# Altium schematic sheet MIXR Power - Connectors.SchDoc: MIXR Power - Connectors
size B; Organization: Midnight Sun Solar Rayce Car Team; Address1: University of Waterloo; Address2: 200 University Ave W; Address3: Waterloo, ON, Canada; Address4: N2L 3E9; DocumentNumber: 3; SheetNumber: 3; SheetTotal: 8; Website: www.uwmidsun.com; ProjectName: ProjectName
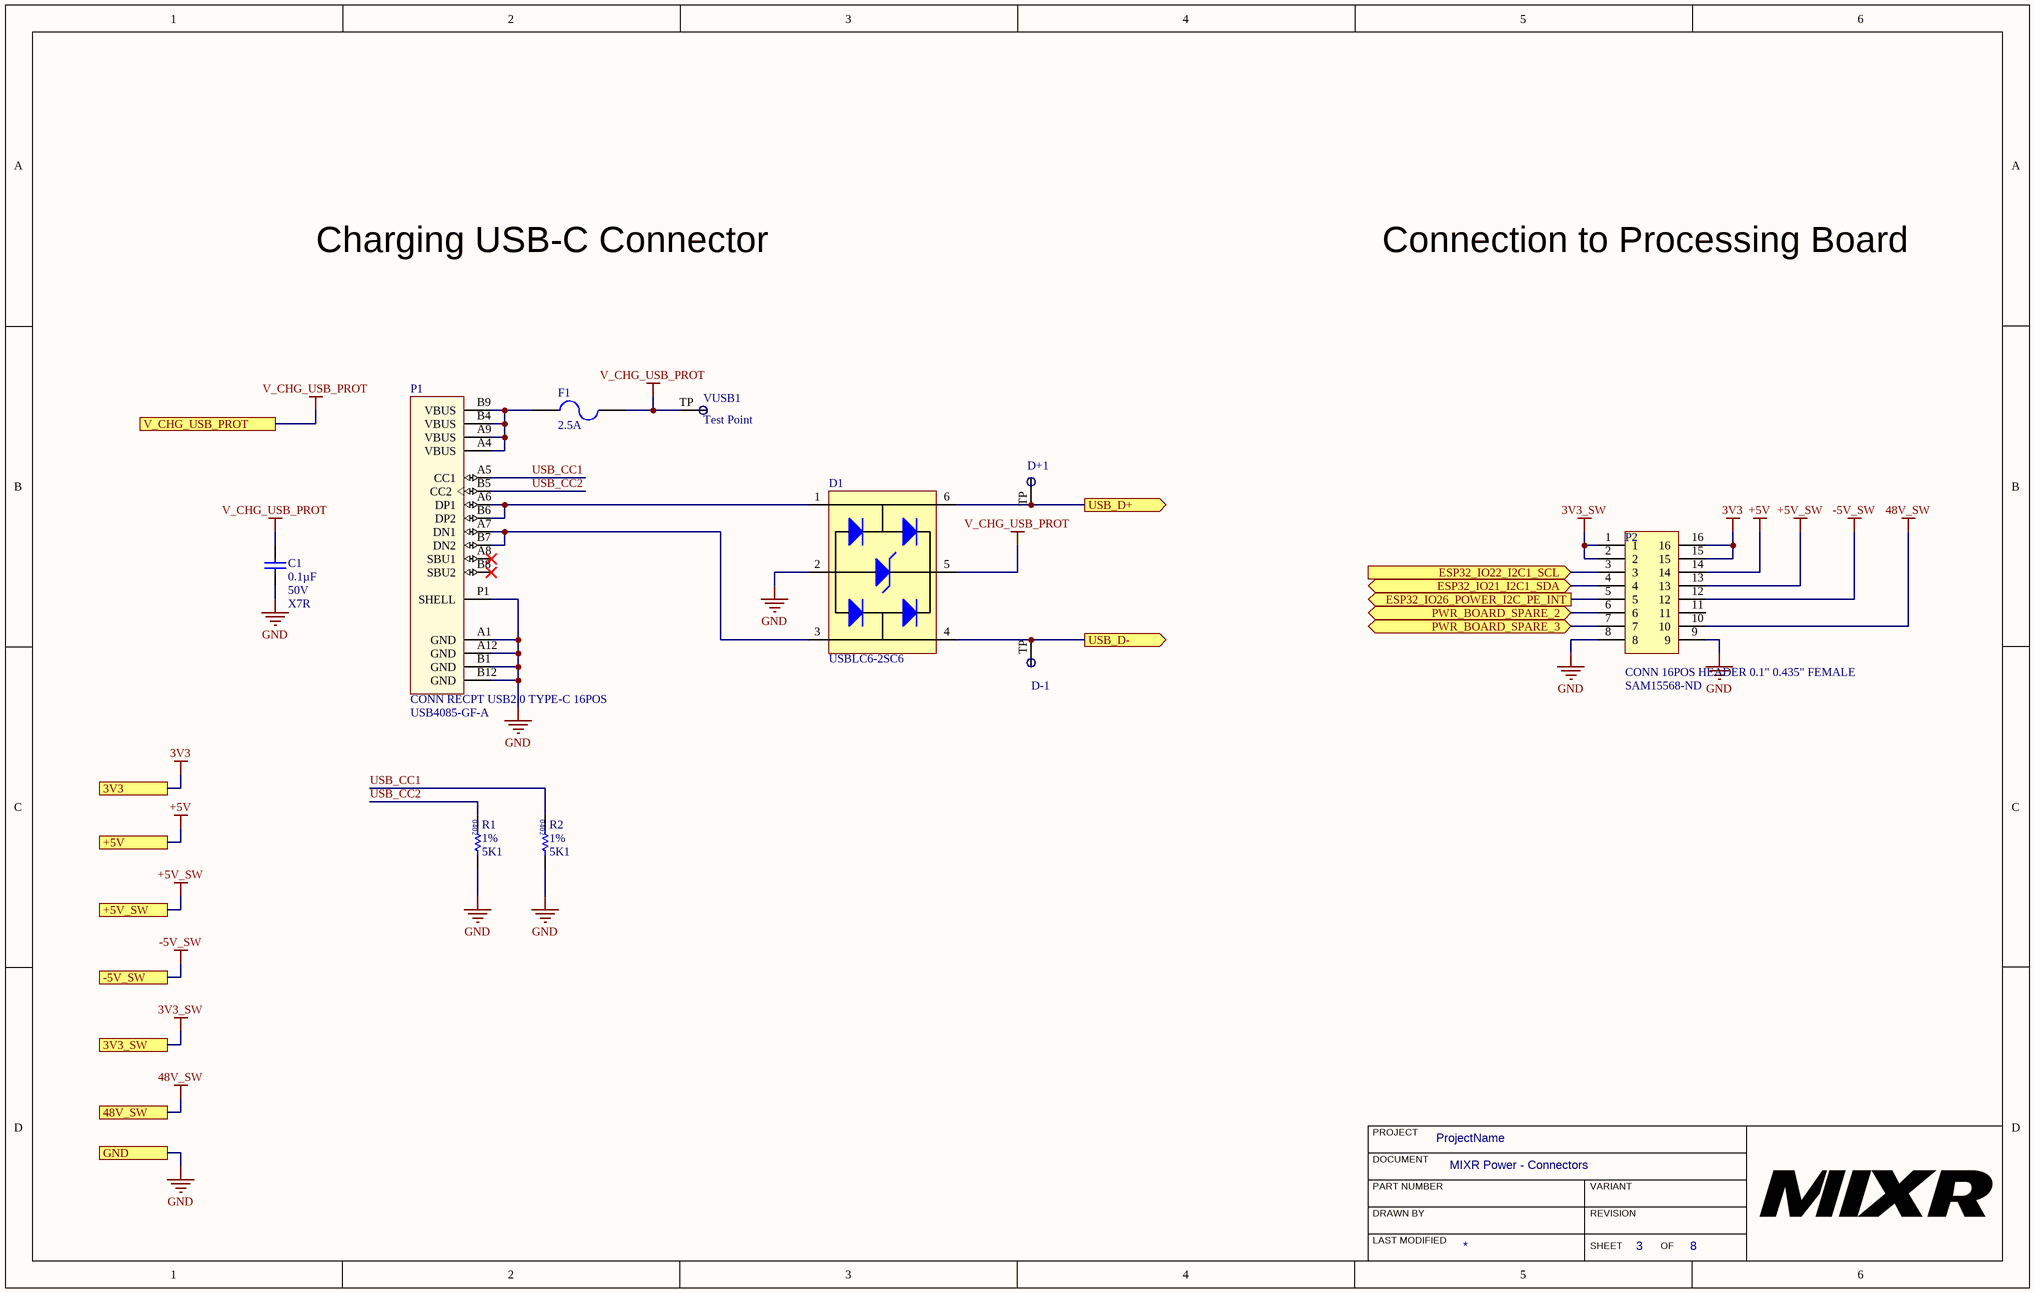
[diagram p0: MIXR Power - Connectors.SchDoc]

## Parts
C1  Capacitance: 0.1µF  Voltage: 50V  Temperature Coefficient: X7R  [CAP, 0603]  (hidden comment: CAP CER 0.1UF 50V 10% X7R 0603)
D1  Manufacturer Part Number 1: USBLC6-2SC6  [SOT23-6]  (hidden comment: DIODE TVS 5.25V 17V SOT23-6)
D+1  Test Point  [Test Point]  (value not drawn)  (no BOM)
D-1  Test Point  [Test Point]  (value not drawn)  (no BOM)
F1  Current Rating: 2.5A  [FUSE LITTLEFUSE 0466 1206]  (hidden comment: FUSE 2.5A 32VDC 1206)
P1  CONN RECPT USB2.0 TYPE-C 16POS  Manufacturer Part Number: USB4085-GF-A  [CONN RECPT USB2.0 TYPE C 16-POS]
P2  CONN 16POS HEADER 0.1" 0.435" FEMALE  Supplier Part Number 1: SAM15568-ND  [CONN, 16POS 0.100" 0.435" FEMALE]
R1  Tolerance: 1%  Resistance: 5K1  [RES 0402]  (hidden comment: RES 5.1K OHM 1% 1/16W 0402)
R2  Tolerance: 1%  Resistance: 5K1  [RES 0402]  (hidden comment: RES 5.1K OHM 1% 1/16W 0402)
VUSB1  Test Point  [Test Point]  (no BOM)

## Ports
3V3, 3V3_SW, 48V_SW, +5V, +5V_SW, -5V_SW, ESP32_IO21_I2C1_SDA (bidir), ESP32_IO22_I2C1_SCL (in), ESP32_IO26_POWER_I2C_PE_INT (out), GND, PWR_BOARD_SPARE_2 (bidir), PWR_BOARD_SPARE_3 (bidir), USB_D+ (out), USB_D- (out), V_CHG_USB_PROT

## Nets
3V3: P2.15 P2.16 ; port 3V3
3V3_SW: P2.1 P2.2 ; port 3V3_SW
48V_SW: P2.10 ; port 48V_SW
+5V: P2.14 ; port +5V
+5V_SW: P2.13 ; port +5V_SW
-5V_SW: P2.12 ; port -5V_SW
GND: C1.2 D1.2(Cathode2) P1.A1(GND) P1.A12(GND) P1.B1(GND) P1.B12(GND) P1.P1(SHELL) P2.8 P2.9 R1.2 R2.2 ; port GND
V_CHG_USB_PROT: C1.1 D1.5(Cathode4) F1.2 VUSB1.TP ; port V_CHG_USB_PROT
ESP32_IO21_I2C1_SDA: P2.4 ; port ESP32_IO21_I2C1_SDA
ESP32_IO22_I2C1_SCL: P2.3 ; port ESP32_IO22_I2C1_SCL
ESP32_IO26_POWER_I2C_PE_INT: P2.5 ; port ESP32_IO26_POWER_I2C_PE_INT
PWR_BOARD_SPARE_2: P2.6 ; port PWR_BOARD_SPARE_2
PWR_BOARD_SPARE_3: P2.7 ; port PWR_BOARD_SPARE_3
USB_CC1: P1.A5(CC1) R2.1
USB_CC2: P1.B5(CC2) R1.1
USB_D+: D1.6(Cathode3) D+1.TP ; port USB_D+
USB_D-: D1.4(Cathode2) D-1.TP ; port USB_D-
NetD1_1: D1.1(Cathode3) P1.A6(DP1) P1.B6(DP2)
NetD1_3: D1.3(Cathode1) P1.A7(DN1) P1.B7(DN2)
NetF1_1: F1.1 P1.A4(VBUS) P1.A9(VBUS) P1.B4(VBUS) P1.B9(VBUS)

Not connected (* = marked no-connect by the designer): P1 A8(SBU1)* B8(SBU2)*; P2 11

## Notes on the sheet
- Charging USB-C Connector
- Connection to Processing Board
- PROJECT
- DOCUMENT
- DRAWN BY
- LAST MODIFIED
- PART NUMBER
- REVISION
- SHEET
- VARIANT
- OF

## Library data of the parts
C1 = CAP CER 0.1UF 50V 10% X7R 0603: 0.10µF ±10% 50V Ceramic Capacitor X7R 0603 (1608 Metric); Manufacturer 1: AVX Corporation; Manufacturer Part Number 1: 06035C104KAT2A; Supplier 1: Digi-Key; Supplier Part Number 1: 478-5052-1-ND; Packaging: Cut Tape (CT); Part Status: Active; Operating Temperature: -55°C ~ 125°C; Ratings: -; Mounting Type: Surface Mount, MLCC; Package / Case: 0603 (1608 Metric); Size / Dimension: 0.063" L x 0.032" W (1.60mm x 0.81mm); Height - Seated (Max): -; Thickness (Max): 0.035" (0.90mm); Lead Spacing: -; Lead Style: -; ComponentLink1URL: http://datasheets.avx.com/X7RDielectric.pdf; ComponentLink1Description: http://datasheets.avx.com/X7RDielectric.pdf; Tolerance: ±10%
D1 = DIODE TVS 5.25V 17V SOT23-6: 17V Clamp 5A (8/20µs) Ipp Tvs Diode Surface Mount SOT-23-6; Manufacturer 1: STMicroelectronics; Data Rate: 480Mbps; Direction: Unidirectional; Capacitance: 3.5pF; Operating Supply Voltage: 1.1V; Number of Elements: 1; Number of Channels: 2; Reverse Breakdown Voltage: 6V; Working Voltage: 5V; Power Line Protection: Yes; Test Current: 1mA; Max Reverse Leakage Current: 150nA; Element Configuration: Dual; Supplier 1: Digi-Key; Stock 1: 7579; Pricing 1: 1=0.47000, 10=0.39900, 100=0.29820, 500=0.23430, 1000=0.18105 (USD); RoHS: Yes; Mount: Surface Mount; Case/Package: SOT-23; Number of Pins: 6; Contact Plating: Tin; Min Operating Temperature: -40°C; Max Operating Temperature: 125°C; Packaging: Tape and Reel; Package Quantity: 3000; Polarity: Unidirectional; Breakdown Voltage: 6V; Clamping Voltage: 17V; Termination: SMD/SMT; Number of Bidirectional Channels: 2; Reverse Standoff Voltage: 5.25V; Min Breakdown Voltage: 6V; ESD Protection: Yes; Max Breakdown Voltage: 6V; Leakage Current: 150nA; Peak Pulse Current: 5A; Length: 3.05mm; Height: 1.3mm; Width: 1.75mm; Depth: 1.75mm; Radiation Hardening: No; REACH SVHC: No SVHC; Lead Free: Lead Free; ComponentLink1URL: https://datasheet.ciiva.com/1268/1690354-1268384.pdf?src-supplier=Element14; ComponentLink1Description: https://datasheet.ciiva.com/1268/1690354-1268384.pdf?src-supplier=Element14; ComponentLink2URL: https://datasheet.ciiva.com/4508/cd00050750-113117-4508433.pdf?src-supplier=Mouser; ComponentLink2Description: https://datasheet.ciiva.com/4508/cd00050750-113117-4508433.pdf?src-supplier=Mouser; ComponentLink3URL: https://datasheet.ciiva.com/15143/getdatasheetpartid-148465-15143789.pdf?src-supplier=Verical; ComponentLink3Description: https://datasheet.ciiva.com/15143/getdatasheetpartid-148465-15143789.pdf?src-supplier=Verical; ComponentLink4URL: https://datasheet.ciiva.com/26787/usblc6-2sc6-26787908.pdf?src-supplier=IIIC; ComponentLink4Description: https://datasheet.ciiva.com/26787/usblc6-2sc6-26787908.pdf?src-supplier=IIIC; ComponentLink5URL: https://datasheet.ciiva.com/16200/cd00050750-16200026.pdf?src-supplier=Future+Electronics; ComponentLink5Description: https://datasheet.ciiva.com/16200/cd00050750-16200026.pdf?src-supplier=Future+Electronics; ComponentLink6URL: https://datasheet.ciiva.com/41444/001184109-da-01-en-ic-esd-protecti-usblc6-2sc6-sot-23-6-stm-41444156.pdf?src-supplier=Conrad; ComponentLink6Description: https://datasheet.ciiva.com/41444/001184109-da-01-en-ic-esd-protecti-usblc6-2sc6-sot-23-6-stm-41444156.pdf?src-supplier=Conrad; Supplier Part Number 1: 497-5235-1-ND
F1 = FUSE 2.5A 32VDC 1206: 2.5A 32V AC 32V DC Fuse Board Mount (Cartridge Style Excluded) Surface Mount 1206 (3216 Metric); Manufacturer 1: Littelfuse; Manufacturer Part Number 1: 046602.5NRHF; DC Cold Resistance: 24mR; Power Dissipation: 192.5mW; Approvals: UL; Supplier 1: Digi-Key; Stock 1: 4995; Pricing 1: 1=0.84000, 5=0.81200, 10=0.78700, 50=0.66180, 100=0.54930, 250=0.49940, 500=0.42450, 1000=0.37455 (USD); RoHS: Yes; Mount: Surface Mount; Case/Package: 1206; Case Code (Metric): 3216; Case Code (Imperial): 1206; Housing Material: Ceramic; Min Operating Temperature: -55°C; Max Operating Temperature: 90°C; Package Quantity: 5000; Voltage Rating (AC): 32V; Voltage Rating (DC): 32V; Packaging: Tape and Reel; Working Voltage: 32V; Fuse Type: Board Mount (Cartridge Style Excluded); Length: 3.18mm; Height: 0.023inch; Width: 0.06inch; Depth: 1.52mm; Lead Free: Lead Free; ComponentLink1URL: https://datasheet.ciiva.com/303/littelfuse-fuse-466-303217.pdf?src-supplier=Digi-Key; ComponentLink1Description: https://datasheet.ciiva.com/303/littelfuse-fuse-466-303217.pdf?src-supplier=Digi-Key; ComponentLink2URL: https://datasheet.ciiva.com/18652/littelfuse-fuse-466-datasheet-pdf-18652469.pdf?src-supplier=Digi-Key; ComponentLink2Description: https://datasheet.ciiva.com/18652/littelfuse-fuse-466-datasheet-pdf-18652469.pdf?src-supplier=Digi-Key; ComponentLink3URL: https://datasheet.ciiva.com/16327/littelfuse-fuse-466-16327471.pdf?src-supplier=Future+Electronics; ComponentLink3Description: https://datasheet.ciiva.com/16327/littelfuse-fuse-466-16327471.pdf?src-supplier=Future+Electronics; Supplier Part Number 1: F6143CT-ND
P1 = CONN RECPT USB2.0 TYPE-C 16POS: USB - C USB 2.0 Receptacle Connector 16 Position Through Hole, Right Angle; Manufacturer: Global Connector Technology; Supplier 1: Digi-Key; Supplier Part Number 1: 2073-USB4085-GF-ACT-ND; Stock 1: 286; Pricing 1: 1 = 1.440000, 10 = 1.307000, 25 = 1.227200, 50 = 1.174000, 100 = 1.120600, 250 = 1.013840 (USD); RoHS: No
P2 = CONN 16POS HEADER 0.1" 0.435" FEMALE: Conn Elevated Socket SKT 16 POS 2.54mm Solder ST Thru-Hole Tube; Manufacturer: Samtec; Manufacturer Part Number: ESQ-108-12-T-D; Max Current Rating: 6.9A; Contact Resistance: 10mR; Max Voltage Rating (AC): 550V; Gender: Receptacle; Number of Contacts: 16; Supplier 1: Digi-Key; RoHS: Yes; Stock 1: 40; Pricing 1: 1=1.84000, 10=1.66800, 100=1.43010, 500=1.19176, 1000=1.02150, 5000=0.90573, 10000=0.88530 (USD); Contact Plating: Tin; Contact Material: Bronze; Housing Material: Polyester; Number of Rows: 2; Packaging: Rail/Tube; Termination: Solder; Length: 20.83mm; Pitch: 2.54mm; ComponentLink1URL: http://components.arrow.com/part/dataview/2753158S6123219N1004?src-supplier=Arrow; ComponentLink1Description: http://components.arrow.com/part/dataview/2753158S6123219N1004?src-supplier=Arrow; ComponentLink2URL: http://www.farnell.com/datasheets/1992053.pdf?src-supplier=Farnell; ComponentLink2Description: http://www.farnell.com/datasheets/1992053.pdf?src-supplier=Farnell; Category: Headers and Wire Housings; Housing Color: Black; Min Operating Temperature: -55°C; Max Operating Temperature: 105°C; Orientation: Vertical; Depth: 4.95mm; Radiation Hardening: No; REACH SVHC: No SVHC; ComponentLink3URL: http://components.arrow.com/part/dataview/0323_01326666?src-supplier=Arrow+Europe; ComponentLink3Description: http://components.arrow.com/part/dataview/0323_01326666?src-supplier=Arrow+Europe; ComponentLink4URL: https://www.verical.com/server-webapp/html/getDatasheet?partID=176003&src-supplier=Verical; ComponentLink4Description: https://www.verical.com/server-webapp/html/getDatasheet?partID=176003&src-supplier=Verical; ComponentLink5URL: http://www.farnell.com/datasheets/1992053.pdf?src-supplier=Newark; ComponentLink5Description: http://www.farnell.com/datasheets/1992053.pdf?src-supplier=Newark; ComponentLink6URL: http://cloud.samtec.com/catalog_english/ESW_TH.PDF?src-supplier=Avnet; ComponentLink6Description: http://cloud.samtec.com/catalog_english/ESW_TH.PDF?src-supplier=Avnet; ComponentLink7URL: http://suddendocs.samtec.com/prints/esq-1xx-xx-x-x-xxx-xx-x-xx-mkt.pdf?src-supplier=Digi-Key; ComponentLink7Description: http://suddendocs.samtec.com/prints/esq-1xx-xx-x-x-xxx-xx-x-xx-mkt.pdf?src-supplier=Digi-Key
R1 R2 = RES 5.1K OHM 1% 1/16W 0402: 5.1 kOhms ±1% 0.063W, 1/16W Chip Resistor 0402 (1005 Metric) Automotive AEC-Q200 Thick Film; Manufacturer: Stackpole Electronics; Manufacturer Part Number: RMCF0402FT5K10; Power Rating: 62.5mW; Max Power Dissipation: 63mW; Temperature Coefficient: 100ppm/°C; Supplier 1: Digi-Key; RoHS: Yes; Category: Chip SMD Resistors; Stock 1: 76800; Pricing 1: 1=0.10000, 10=0.01400, 100=0.00580, 1000=0.00262, 2500=0.00228, 5000=0.00188 (USD); Mount: Surface Mount; Case/Package: 0402; Case Code (Metric): 1005; Case Code (Imperial): 0402; Contact Plating: Tin,Matte; Min Operating Temperature: -55°C; Max Operating Temperature: 155°C; Packaging: Tape and Reel; Composition: Thick Film; Number of Terminations: 2; Features: Automotive AEC-Q200; Length: 0.039inch; Height: 0.016inch; Width: 0.02inch; Radiation Hardening: No; ComponentLink1URL: https://www.seielect.com/catalog/SEI-RMCF_RMCP.pdf?src-supplier=Avnet; ComponentLink1Description: https://www.seielect.com/catalog/SEI-RMCF_RMCP.pdf?src-supplier=Avnet; ComponentLink2URL: https://www.seielect.com/catalog/SEI-Packaging.pdf?src-supplier=Digi-Key; ComponentLink2Description: https://www.seielect.com/catalog/SEI-Packaging.pdf?src-supplier=Digi-Key; ComponentLink3URL: http://components.arrow.com/part/dataview/51396875S385758N1174?src-supplier=Arrow; ComponentLink3Description: http://components.arrow.com/part/dataview/51396875S385758N1174?src-supplier=Arrow; ComponentLink4URL: https://www.seielect.com/catalog/SEI-RMCF_RMCP.pdf?src-supplier=Avnet+Asia; ComponentLink4Description: https://www.seielect.com/catalog/SEI-RMCF_RMCP.pdf?src-supplier=Avnet+Asia; Supplier Part Number 1: RMCF0402FT5K10CT-ND